# EAGLE schematic Jacdac_Pressure_Sensor (EAGLE 9.6.2)
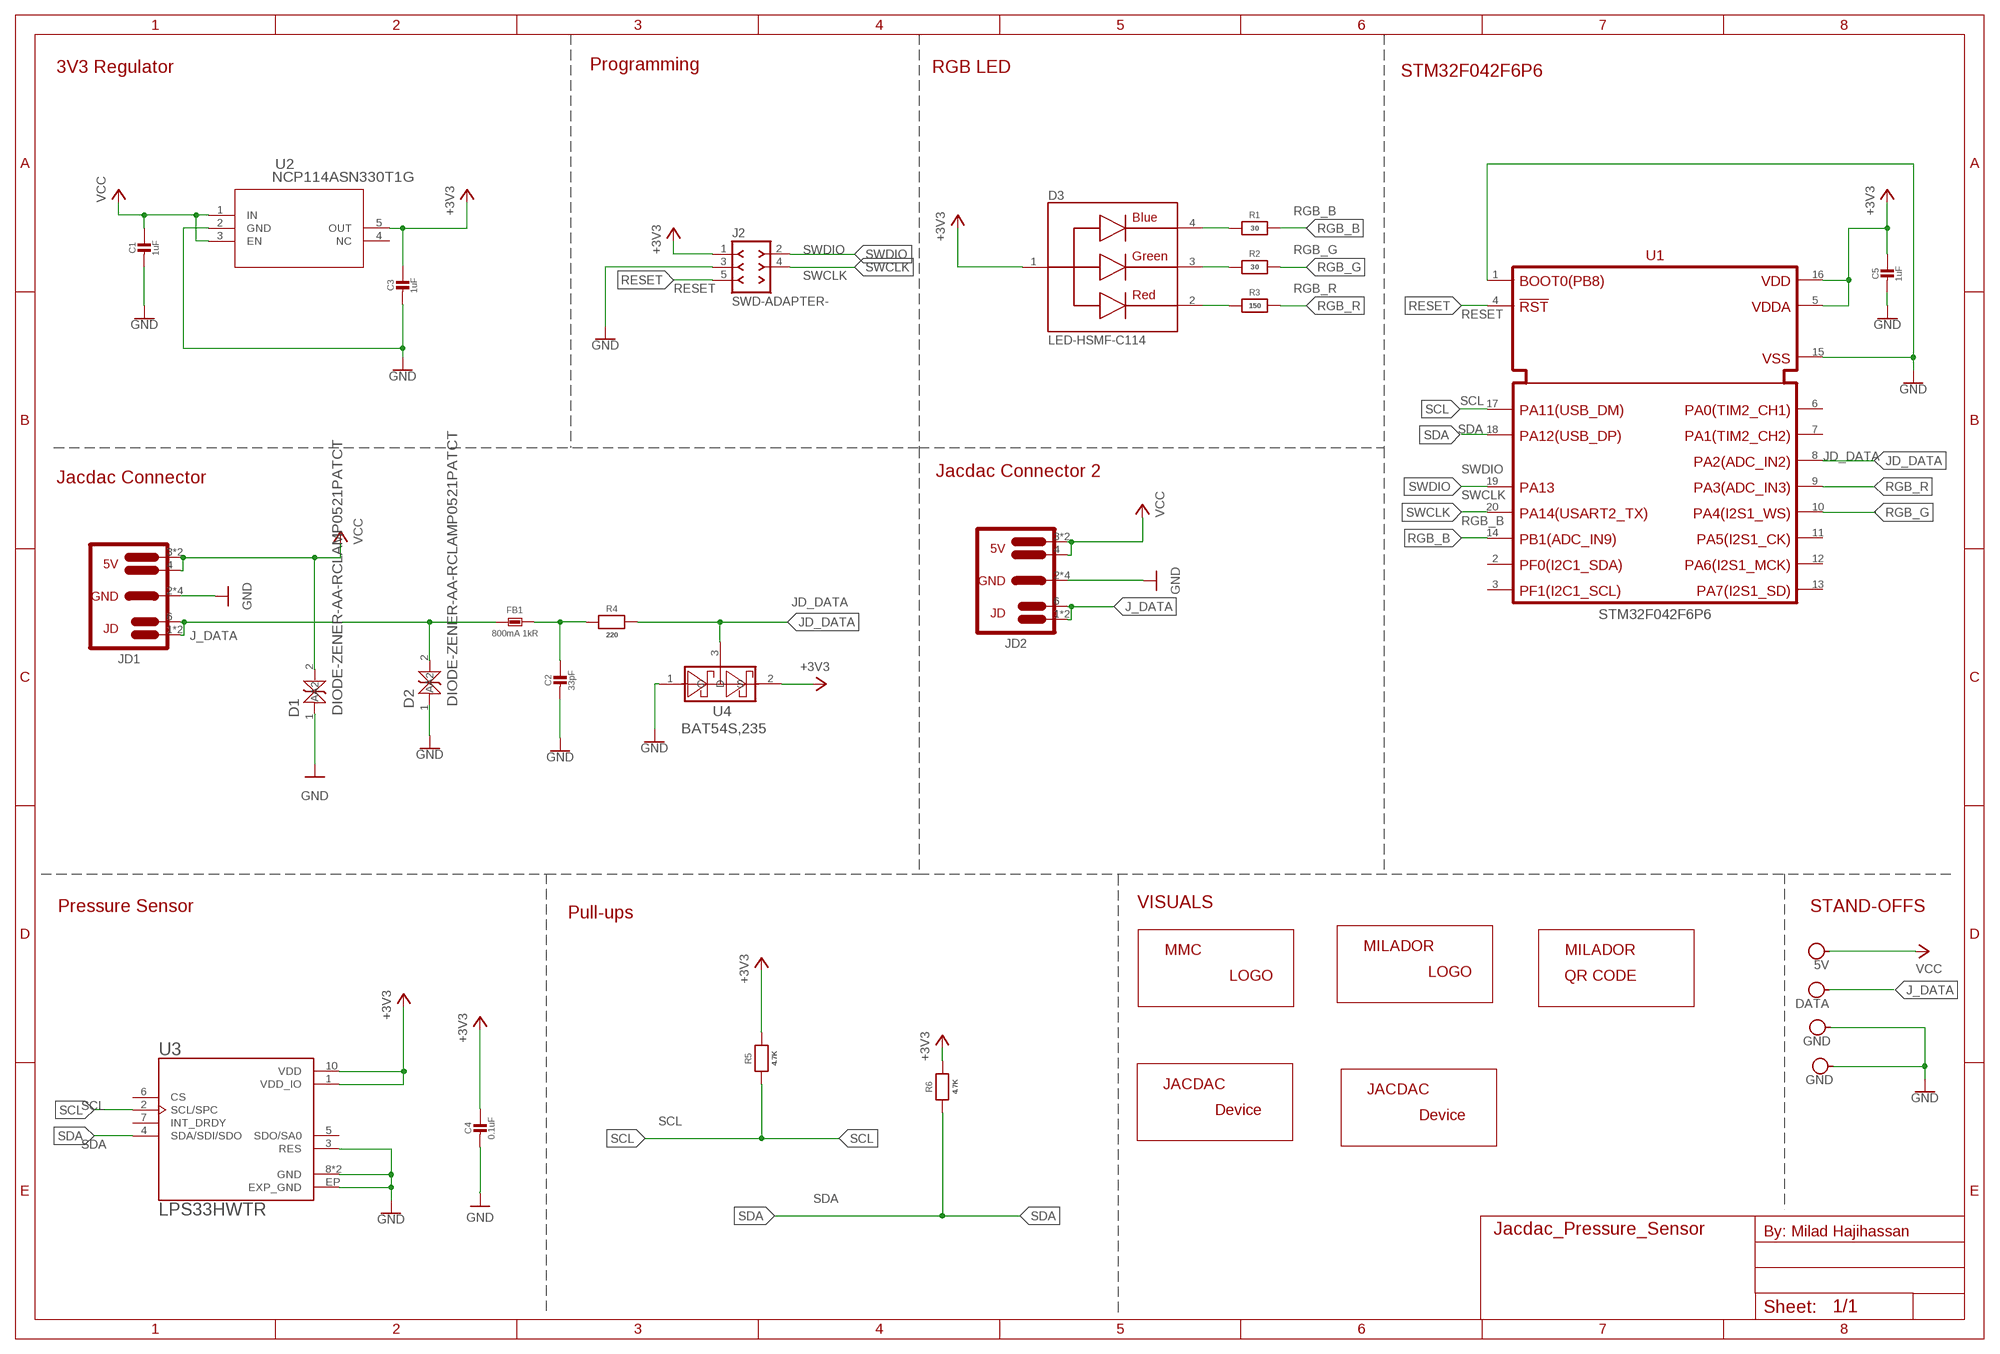
[diagram p0: schematic, sheet 1]

## Parts
C1  1uF  CAP_CERAMIC-0603-NO  [0603-NO]
C2  33pF  CAP_CERAMIC-0603  [0603]
C3  1uF  CAP_CERAMIC-0603-NO  [0603-NO]
C4  0.1uF  CAP_CERAMIC-0603-NO  [0603-NO]
C5  1uF  CAP_CERAMIC-0603  [0603]
D1  DIODE-ZENER-AA-RCLAMP0521PATCT  [DIODE-ZENER-0402]
D2  DIODE-ZENER-AA-RCLAMP0521PATCT  [DIODE-ZENER-0402]
D3  LED-HSMF-C114  [DIOSC160X150X35-4N]
FB1  800mA 1kR  FERRITE-BEAD-0603-NO  [0603-NO]
J2  SWD-ADAPTER-  [SWD-ADAPTER]
J3  5V  JACDAC-M3-PWR-OUTL  [M3-HOLE-PWR-OUTL]
J4  DATA  JACDAC-M3-DATA-NOTCH  [M3-HOLE-DATA-NOTCH]
J5  GND  JACDAC-M3-GND  [M3-HOLE-GND]
J6  GND  JACDAC-M3-GND  [M3-HOLE-GND]
JD1  JACDAC-EDGE-OUTIE  [JD-EDGE-OUTIE]
JD2  JACDAC-EDGE-OUTIE  [JD-EDGE-OUTIE]
LABEL_JACDAC_PS  MILADOR-JACDAC-DEVICE-PS  [JACDAC-PRESSURE-SENSOR]
LABEL_LPS33HW  MILADOR-JACDAC-DEVICE-LPS33HW  [JACDAC-LPS33HW]
LABEL_MILADOR  MILADOR-LOGO-  [MILADOR_LOGO1]
LABEL_QR_CODE  MILADOR-QR-CODE-JACDAC-GITHUB-PS  [MILADOR_QR_JACDAC_PS]
MMC_LOGO  MMC_LOGO-XSM  [MMC_X-SMALL_LOGO]
R1  30  RESISTOR-0603  [0603]
R2  30  RESISTOR-0603  [0603]
R3  150  RESISTOR-0603  [0603]
R4  220  RESISTOR-0603  [0603]
R5  4.7K  RESISTOR-0603  [0603]
R6  4.7K  RESISTOR-0603  [0603]
U1  STM32F042F6P6  [TSSOP20]
U2  NCP114ASN330T1G  [TSOP-5_ONS]
U3  LPS33HWTR  [PQFN60P330X330X290-11N]
U4  BAT54S,235  [SOT23-3]

## Nets
+3V3: C3.1 C4.1 C5.1 D3.1 J2.1(VCC_1) R5.2 R6.2 U1.5(VDDA) U1.16(VDD) U2.5(OUT) U3.1(VDD_IO) U3.10(VDD) U4.2(S)
GND: C1.2 C2.2 C3.2 C4.2 C5.2 D1.1(A) D2.1(A) J2.3(GND_3) J5.H J6.H JD1.2 JD1.5 JD1.P$2 JD1.P$4 JD2.2 JD2.5 JD2.P$2 JD2.P$4 U1.1(BOOT0) U1.15(VSS) U2.2(GND) U3.3(RES) U3.8(GND) U3.9(GND) U3.EP(EXP_GND) U4.1(G)
J_DATA: D2.2(A2) FB1.2 J4.H JD1.1 JD1.6 JD1.P$3 JD2.1 JD2.6 JD2.P$3
JD_DATA: R4.2 U1.8(PA2) U4.3(D)
N$1: D3.4 R1.1
N$2: D3.3 R2.1
N$3: D3.2 R3.1
N$4: C2.1 FB1.1 R4.1
RESET: J2.5(RESET_5) U1.4(!RST)
RGB_B: R1.2 U1.14(PB1)
RGB_G: R2.2 U1.10(PA4)
RGB_R: R3.2 U1.9(PA3)
SCL: R5.1 U1.17(PA11) U3.2(SCL/SPC)
SDA: R6.1 U1.18(PA12) U3.4(SDA/SDI/SDO)
SWCLK: J2.4(SWCLK_4) U1.20(PA14)
SWDIO: J2.2(SWDIO_2) U1.19(PA13)
VCC: C1.1 D1.2(A2) J3.H JD1.3 JD1.4 JD1.P$1 JD2.3 JD2.4 JD2.P$1 U2.1(IN) U2.3(EN)
Unconnected: U1.2(PF0) U1.3(PF1) U1.6(PA0) U1.7(PA1) U1.11(PA5) U1.12(PA6) U1.13(PA7) U2.4(NC) U3.5(SDO/SA0) U3.6(CS) U3.7(INT_DRDY)

## Notes on the sheet
- 3V3 Regulator | Programming | RGB LED
- STM32F042F6P6
- Jacdac Connector 2
- Jacdac Connector
- Pressure Sensor | VISUALS | STAND-OFFS
- Pull-ups
- By: Milad Hajihassan

## Library data of the parts
C1-C5 = milador_SMD:CAP_CERAMIC-: Ceramic Capacitors For new designs, use the packages preceded by an '_' character since they are more reliable: The following footprints should be used on most boards: _0402 - Standard footprint for regular board layouts _0603 - Standard footprint for regular board layouts _0805 - Standard footprint for regular board layouts _1206 - Standard footprint for regular board layouts For extremely tight-pitch boards where space is at a premium, the following 'micro-pitch' footprints can be used (smaller pads, no silkscreen outline, etc.): _0402MP - Micro-pitch footprint for very dense/compact boards _0603MP - Micro-pitch footprint for very dense/compact boards _0805MP - Micro-pitch footprint for very dense/compact boards _1206MP - Micro-pitch footprint for very dense/compact boards
D1 D2 = milador_SMD:DIODE-ZENER-AA-; COPYRIGHT: Copyright (C) 2021 Ultra Librarian. All rights reserved.; DIGI-KEY_PART_NUMBER_1: RCLAMP0521PACT-ND; DIGI-KEY_PART_NUMBER_2: RCLAMP0521PADKR-ND; DIGI-KEY_PART_NUMBER_3: RCLAMP0521PATR-ND; MANUFACTURER_PART_NUMBER: RCLAMP0521PATCT; MFR_NAME: Semtech
D3 = milador_SMD:LED-HSMF-C114: LED Tri-Color Blue/Green/Red 468nm/523nm/637nm 4-Pin Chip LED T/R Check prices <https://pricing.snapeda.com/parts/HSMF-C114/Broadcom%20Limited/view-part?ref=eda>; DESCRIPTION: Red, Green, Blue (RGB) 626nm Red, 525nm Green, 470nm Blue LED Indication - Discrete 1.9V Red, 3.4V Green, 3.4V Blue 0606 (1616 Metric); MF: Broadcom Limited; MP: HSMF-C114; PACKAGE: 0606 Avago; PRICE: None; PURCHASE-URL: https://pricing.snapeda.com/search/part/HSMF-C114/?ref=eda
FB1 = milador_SMD:FERRITE-BEAD-: Ferrite Beads
J2 = milador:SWD-ADAPTER-
J3-J6 = milador:JACDAC-M3: Jacdac mounting Hole M3
JD1 JD2 = milador:JACDAC-EDGE
LABEL_JACDAC_PS LABEL_LPS33HW = milador:MILADOR-JACDAC-DEVICE-
LABEL_MILADOR = milador:MILADOR-LOGO-
LABEL_QR_CODE = milador:MILADOR-QR-CODE-
MMC_LOGO = MMC Eagle:MMC_LOGO-
R1-R6 = milador_SMD:RESISTOR-: Resistors For new designs, use the packages preceded by an '_' character since they are more reliable: The following footprints should be used on most boards: _0402 - Standard footprint for regular board layouts _0603 - Standard footprint for regular board layouts _0805 - Standard footprint for regular board layouts _1206 - Standard footprint for regular board layouts For extremely tight-pitch boards where space is at a premium, the following 'micro-pitch' footprints can be used (smaller pads, no silkscreen outline, etc.): _0402MP - Micro-pitch footprint for very dense/compact boards _0603MP - Micro-pitch footprint for very dense/compact boards _0805MP - Micro-pitch footprint for very dense/compact boards _1206MP - Micro-pitch footprint for very dense/compact boards
U1 = milador_SMD:STM32F042F6P6; MOUSER: 511-STM32F042F6P6
U2 = milador_SMD:NCP114ASN330T1G; COPYRIGHT: Copyright (C) 2021 Ultra Librarian. All rights reserved.; DIGI-KEY_PART_NUMBER_1: 2156-NCP114ASN330T1G-ND; DIGI-KEY_PART_NUMBER_2: 2156-NCP114ASN330T1G-OS-ND; DIGI-KEY_PART_NUMBER_3: NCP114ASN330T1GOSCT-ND; DIGI-KEY_PART_NUMBER_4: NCP114ASN330T1GOSDKR-ND; DIGI-KEY_PART_NUMBER_5: NCP114ASN330T1GOSTR-ND; MANUFACTURER_PART_NUMBER: NCP114ASN330T1G; MFR_NAME: ON Semiconductor
U3 = milador_SMD:LPS33HWTR: Pressure Sensor; DESCRIPTION: Pressure Sensor 3.77PSI ~ 18.27PSI (26kPa ~ 126kPa) Absolute 24 b LGA; DIGI-KEY_PART_NUMBER: 497-17590-1-ND; MF: STMicroelectronics; MP: LPS33HWTR; PACKAGE: LGA STMicroelectronics
U4 = milador_SMD:BAT54S,235: BAT54S,235 Schottky Diode; DESCRIPTION: N-Channel 50V 200mA (Ta) 300mW (Ta) Surface Mount SOT-23-3; MF: Diodes; MP: BSS138-7-F; PACKAGE: SOT-23-3 Fairchild Semiconductor; PRICE: None; PURCHASE-URL: https://pricing.snapeda.com/search/part/BSS138-7-F/?ref=eda